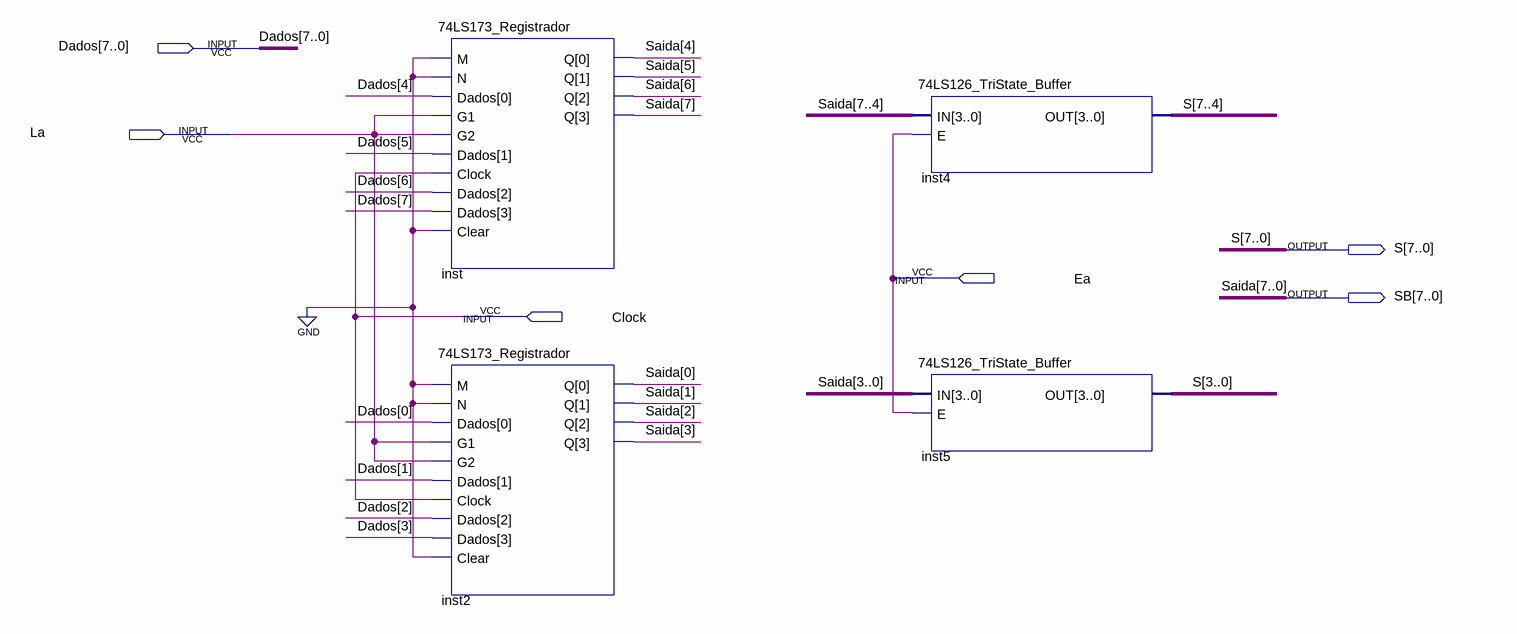
[diagram p0: schematic sheet]
// Quartus schematic Acumulador_A.bdf as structural Verilog: 4 symbols, 6 pins
module Acumulador_A (
  input  [7:0] Dados,
  input  La,
  input  Ea,
  input  Clock,
  output [7:0] S,
  output [7:0] SB
);

  \74LS173_Registrador  inst (
    .M(1'b0), .N(1'b0), .Dados(Dados[7:4]), .G1(La), .G2(La), .Clock(Clock), .Clear(1'b0), .Q(SB[7:4]));
  \74LS173_Registrador  inst2 (
    .M(1'b0), .N(1'b0), .Dados(Dados[3:0]), .G1(La), .G2(La), .Clock(Clock), .Clear(1'b0), .Q(SB[3:0]));
  \74LS126_TriState_Buffer  inst4 (.IN(SB[7:4]), .E(Ea), .OUT(S[7:4]));
  \74LS126_TriState_Buffer  inst5 (.IN(SB[3:0]), .E(Ea), .OUT(S[3:0]));

  // Other names for the same wires on the sheet: Saida[7:0] = SB
endmodule
